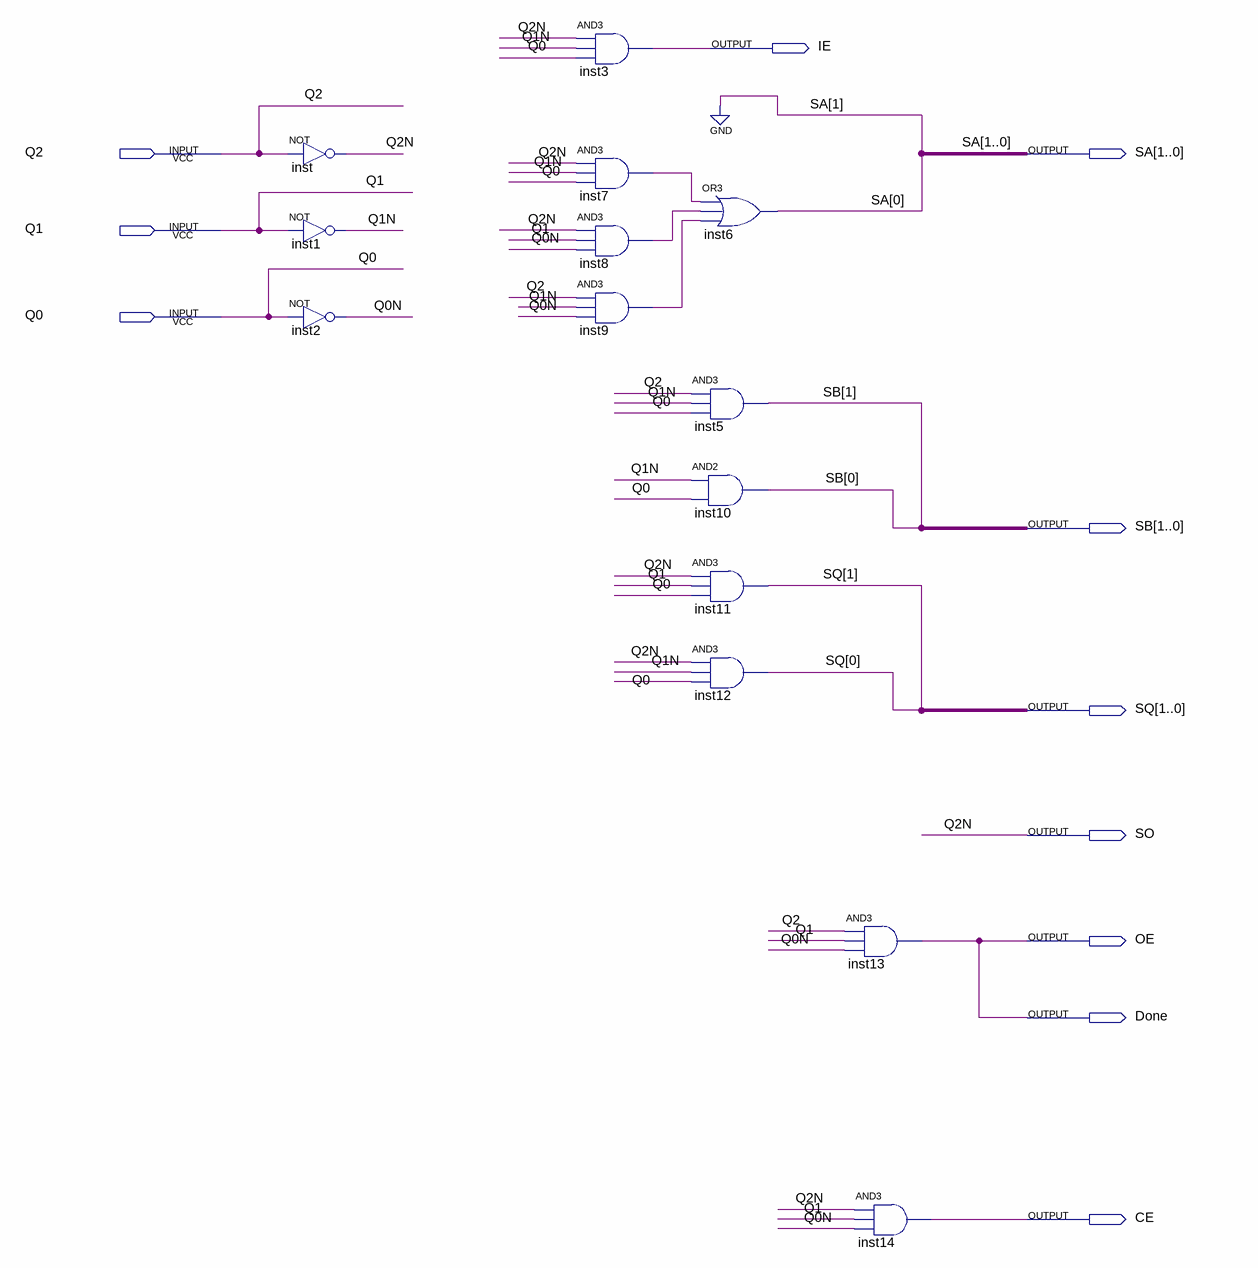
[diagram p0: schematic sheet]
// Quartus schematic output_control.bdf as structural Verilog: 14 symbols, 11 pins
module output_control (
  input  Q2,
  input  Q1,
  input  Q0,
  output IE,
  output [1:0] SA,
  output [1:0] SB,
  output [1:0] SQ,
  output SO,
  output OE,
  output Done,
  output CE
);

  wire inst7_out, inst8_out, inst9_out, Q0N, Q1N;

  not inst (SO, Q2);
  not inst1 (Q1N, Q1);
  not inst2 (Q0N, Q0);
  and inst3 (IE, SO, Q1N, Q0);
  and inst7 (inst7_out, SO, Q1N, Q0);
  and inst8 (inst8_out, SO, Q1, Q0N);
  and inst9 (inst9_out, Q2, Q1N, Q0N);
  or inst6 (SA[0], inst7_out, inst8_out, inst9_out);
  and inst5 (SB[1], Q2, Q1N, Q0);
  and inst10 (SB[0], Q1N, Q0);
  and inst11 (SQ[1], SO, Q1, Q0);
  and inst12 (SQ[0], SO, Q1N, Q0);
  and inst13 (Done, Q2, Q1, Q0N);
  and inst14 (CE, SO, Q1, Q0N);

  assign OE = Done;
  assign SA[1] = 1'b0;

  // Other names for the same wires on the sheet: Q2N = SO
endmodule
